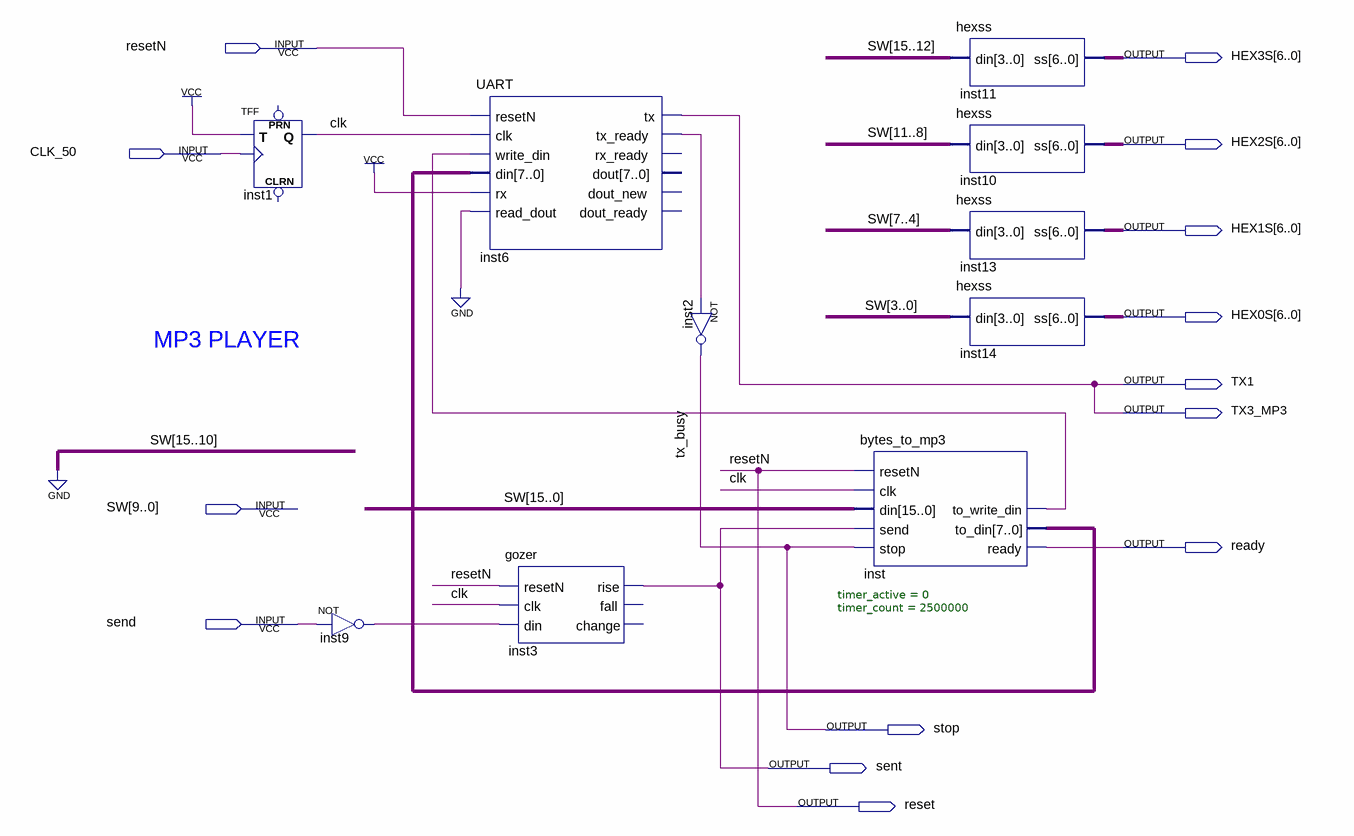
[diagram p0: schematic sheet]
// Quartus schematic test_mp3_player.bdf as structural Verilog: 10 symbols, 14 pins
module test_mp3_player (
  input  resetN,
  input  CLK_50,
  input  [9:0] SW,
  input  send,
  output [6:0] HEX3S,
  output [6:0] HEX2S,
  output [6:0] HEX1S,
  output [6:0] HEX0S,
  output TX1,
  output TX3_MP3,
  output ready,
  output stop,
  output sent,
  output reset
);

  wire clk, inst6_tx_ready, inst9_out, inst_to_write_din;
  wire [7:0] inst_to_din;

  TFF inst1 (.T(1'b1), .CLK(CLK_50), .Q(clk));  // open: PRN, CLRN
  not inst9 (inst9_out, send);
  UART inst6 (
    .resetN(resetN), .clk(clk), .write_din(inst_to_write_din), .din(inst_to_din), .rx(1'b1),
    .read_dout(1'b0), .tx(TX1), .tx_ready(inst6_tx_ready));  // open: rx_ready, dout, dout_new, dout_ready
  gozer inst3 (.resetN(resetN), .clk(clk), .din(inst9_out), .rise(sent));  // open: fall, change
  not inst2 (stop, inst6_tx_ready);
  bytes_to_mp3 #(.timer_active(0), .timer_count(2500000)) inst (
    .resetN(resetN), .clk(clk), .din({{6{1'b0}}, SW}), .send(sent), .stop(stop),
    .to_write_din(inst_to_write_din), .to_din(inst_to_din), .ready(ready));
  hexss inst11 (.din(4'b0000), .ss(HEX3S));
  hexss inst10 (.din({2'b00, SW[9:8]}), .ss(HEX2S));
  hexss inst13 (.din(SW[7:4]), .ss(HEX1S));
  hexss inst14 (.din(SW[3:0]), .ss(HEX0S));

  assign reset = resetN;
  assign TX3_MP3 = TX1;

  // Other names for the same wires on the sheet: tx_busy = stop

  // Notes on the sheet:
  //   MP3 PLAYER
endmodule
